# Altium schematic sheet RS485.SchDoc
size A
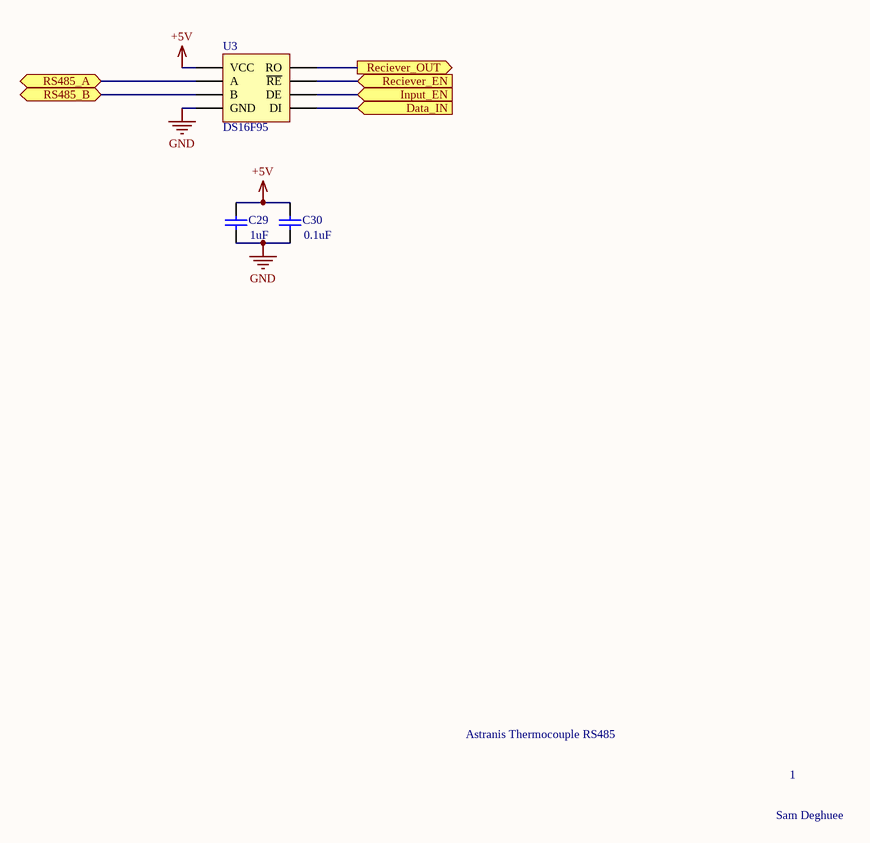
[diagram p0: RS485.SchDoc]

## Parts
C29  value 1uF  [CAPC0603(1608)100_L]  (hidden comment: CAP0603)
C30  value 0.1uF  [CAPC0603(1608)100_L]  (hidden comment: CAP0603)
U3  DS16F95

## Ports
Data_IN (in), Input_EN (in), Reciever_EN (in), Reciever_OUT (out), RS485_A (bidir), RS485_B (bidir)

## Nets
+5V: C29.2 C30.2 U3.?6(VCC)
GND: C29.1 C30.1 U3.?5(GND)
Data_IN: U3.?4(DI) ; port Data_IN
Input_EN: U3.?3(DE) ; port Input_EN
Reciever_EN: U3.?2(~{RE}) ; port Reciever_EN
Reciever_OUT: U3.?1(RO) ; port Reciever_OUT
RS485_A: U3.?7(A) ; port RS485_A
RS485_B: U3.?8(B) ; port RS485_B

## Notes on the sheet
- Astranis Thermocouple RS485
- 1
- Sam Deghuee

## Library data of the parts
C29 C30 = CMP-1590-00005-1: 0603 (1608 Metric) Chip Capacitor; Case-Metric: 1608; Case-EIA: 0603; PackageReference: CAPC0603(1608)100
U3 = DS16F95QML: The DS16F95 Differential Bus Transceiver is a monolithic integrated circuit designed for bidirectional data communication on balanced multipoint bus transmission lines. The transceiver meets EIA standard RS-485 as well as RS-422A.; ComponentLink1Description: Datasheet; ComponentLink1URL: http://www.ti.com/lit/ds/symlink/ds16f95qml-sp.pdf